# EAGLE design vacuum_sensor (EAGLE 6.5.0)
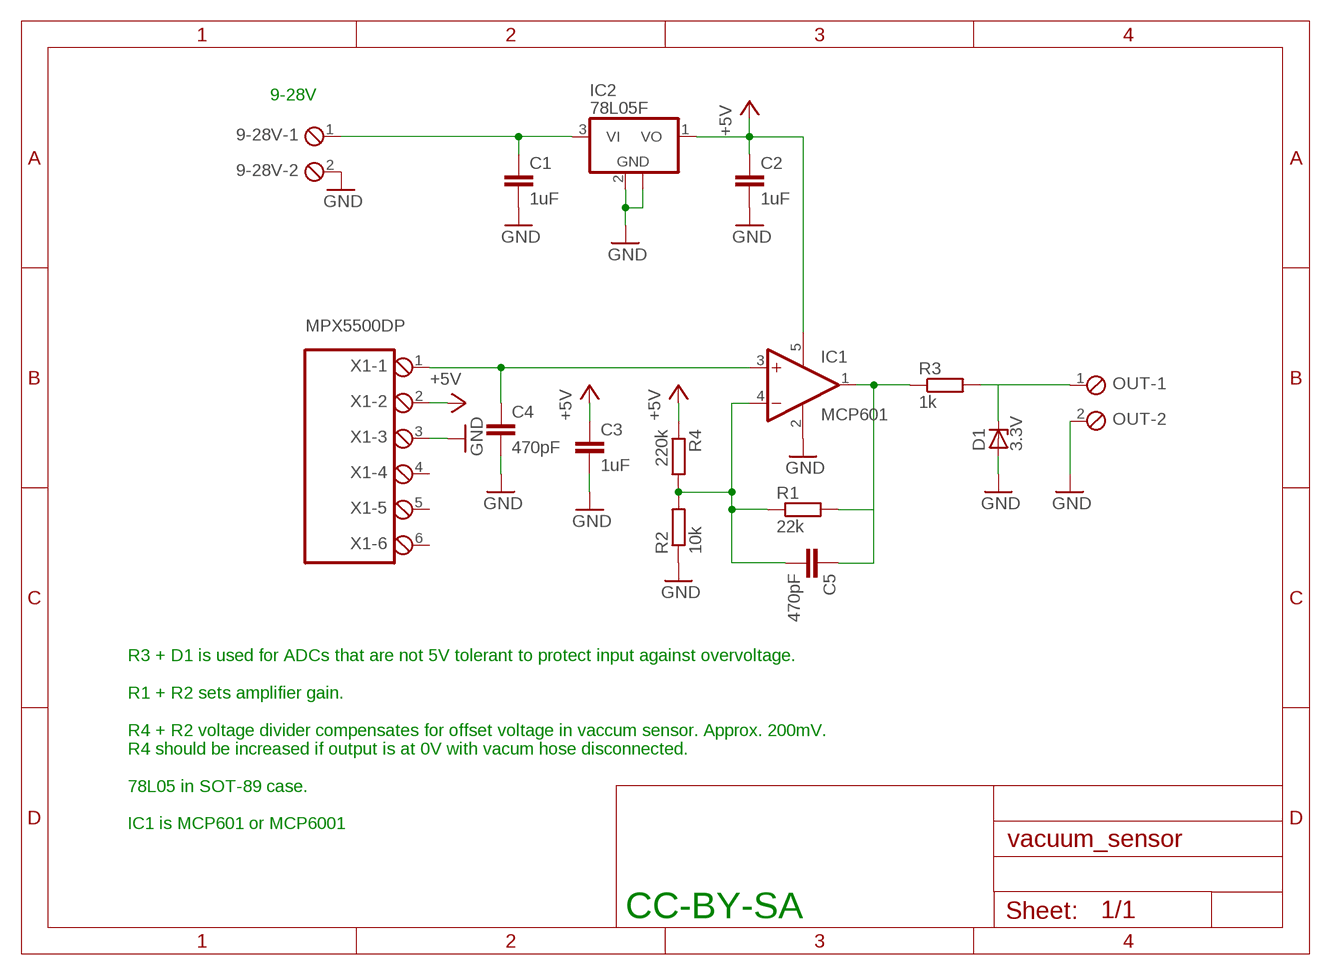
[diagram p0: schematic, sheet 1]

## Parts
9-28V  MPT2  [2POL254]
C1  1uF  C-EUC0805  [C0805]
C2  1uF  C-EUC0805  [C0805]
C3  1uF  C-EUC0805  [C0805]
C4  470pF  C-EUC0805  [C0805]
C5  470pF  C-EUC0805  [C0805]
D1  3.3V  ZENER-DIODESOT23  [SOT23]
IC1  MCP601  MCP601OT  [SOT23-5]
IC2  78L05F  [SOT89]
OUT  MPT2  [2POL254]
R1  22k  R-EU_R0805  [R0805]
R2  10k  R-EU_R0805  [R0805]
R3  1k  R-EU_R0805  [R0805]
R4  220k  R-EU_R0805  [R0805]
X1  MPT6  [6POL254]

## Nets
+5V: C2.1 C3.1 IC1.5(V+) IC2.1(VO) R4.1 X1.2
GND: 9-28V.2 C1.2 C2.2 C3.2 C4.2 D1.1(A) IC1.2(V-) IC2.2(GND) IC2.2@1(GND) OUT.2 R2.1 X1.3
N$1: C5.2 IC1.4(-IN) R1.1 R2.2 R4.2
N$2: 9-28V.1 C1.1 IC2.3(VI)
N$3: C5.1 IC1.1(OUT) R1.2 R3.1
N$4: C4.1 IC1.3(+IN) X1.1
N$5: D1.3(C) OUT.1 R3.2
Unconnected: X1.4 X1.5 X1.6

## Notes on the sheet
- 9-28V
- MPX5500DP
- R3 + D1 is used for ADCs that are not 5V tolerant to protect input against overvoltage. 
  
  R1 + R2 sets amplifier gain.
  
  R4 + R2 voltage divider compensates for offset voltage in vaccum sensor. Approx. 200mV.   
  R4 should be increased if output is at 0V with vacum hose disconnected. 
  
  78L05 in SOT-89 case.
  
  IC1 is MCP601 or MCP6001
- CC-BY-SA

## Library data of the parts
9-28V OUT = con-phoenix-254:MPT2: PHOENIX CONNECTOR; OC_FARNELL: unknown; OC_NEWARK: unknown
C1-C5 = rcl:C-EU: CAPACITOR, European symbol
D1 = diode:ZENER-DIODE: Z-Diode
IC1 = linear:MCP601: Single Op Amp 2.7V to 6.0V Single Supply CMOS Source: http://ww1.microchip.com/downloads/en/DeviceDoc/21314g.pdf
IC2 = linear:78L*: POSITOIV-VOLTAGE REGULATORS Output up to 100 mA Source: http://focus.ti.com/lit/ds/symlink/ua78l05.pdf
R1-R4 = rcl:R-EU_: RESISTOR, European symbol
X1 = con-phoenix-254:MPT6: PHOENIX CONNECTOR; OC_FARNELL: unknown; OC_NEWARK: unknown

## Board
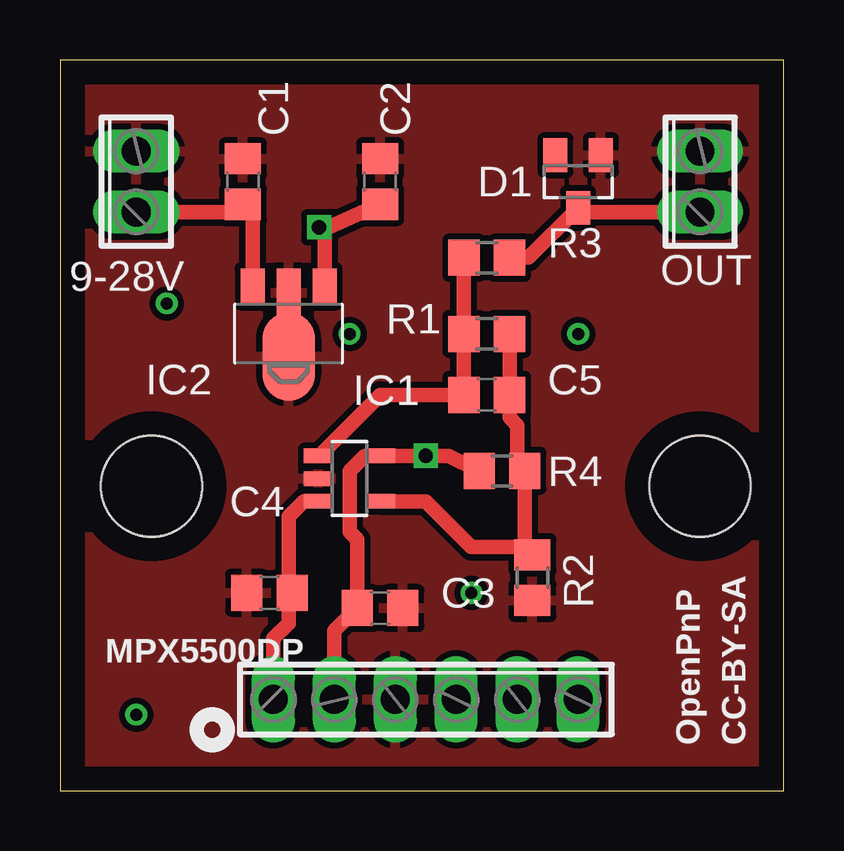
[diagram p1: board, top side]
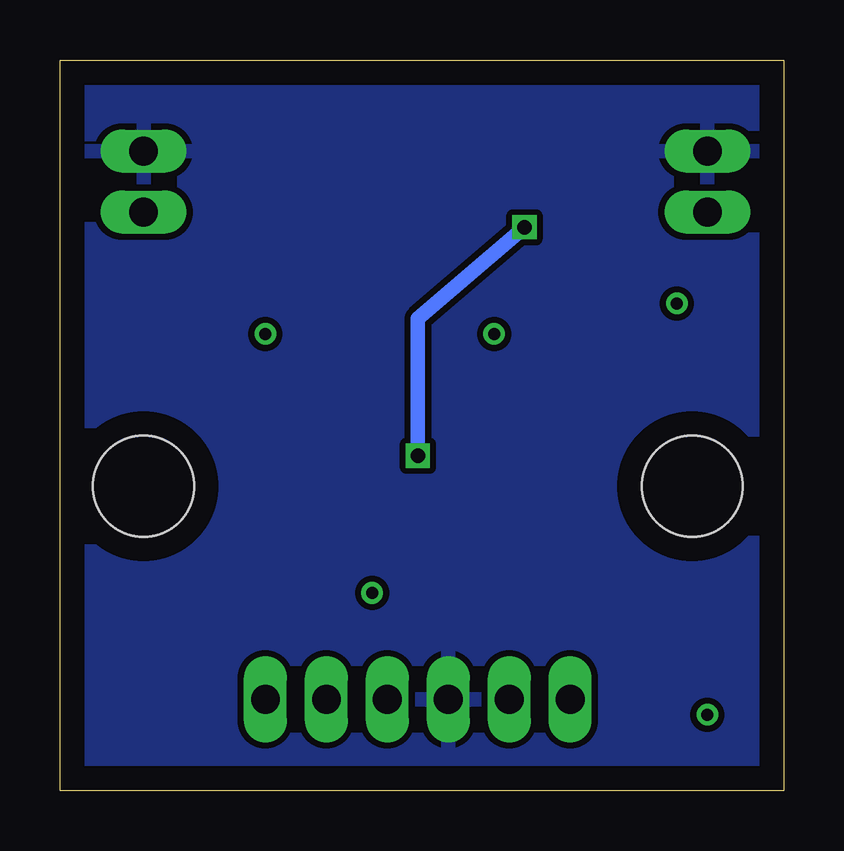
[diagram p2: board, bottom side, seen from below]

Size 30.15 x 30.47 mm. Coordinates in mm from the lower left corner, seen from the top.
Outline: 0,0 30.15,0 30.15,30.47 0,30.47 0,0
Copper layers (1*16): Top 0.035mm / dielectric 1.5mm / Bottom 0.035mm
Design rules "default *": minimum track width 10mil, minimum drill 24mil, track to track 10mil, track to pad 10mil, pad to pad 10mil, via to via 10mil, smd to smd 8mil, copper to edge 40mil, drill to drill 8mil, minimum pad ring 10mil, minimum via ring 8mil, stop-mask expansion 4mil, vias tented up to drill 0mil, thermal gap 10mil
Holes 4.2 mm at 3.81,12.7 26.67,12.7

### Footprints (pad centres in the part's own frame; a part is rotated, then mirrored left to right if it is on the bottom)
2POL254 = drill 1.2 long: 1 -1.27,0; 2 1.27,0
C0805 = smd 1.3 x 1.5: 1 -0.95,0; 2 0.95,0
SOT23 = smd 1 x 1.4: 1 -0.95,-1.1; 2 0.95,-1.1; 3 0,1.1
SOT23-5 = smd 0.6 x 1.2: 1 -0.95,-1.306; 2 0,-1.306; 3 0.95,-1.306; 4 0.95,1.306; 5 -0.95,1.306
SOT89 = smd 1 x 1.5: 1 -1.499,-1.981; 3 1.499,-1.981 | smd 1 x 2: 2 0,-1.727 | smd 2.2 x 3.7: 2@1 0,0.94
R0805 = smd 1.3 x 1.5: 1 -0.95,0; 2 0.95,0
6POL254 = drill 1.2 pad 1.778 long: 1 -6.35,0; 2 -3.81,0; 3 -1.27,0; 4 1.27,0; 5 3.81,0; 6 6.35,0

### Placement (x,y rotation side)
9-28V  3.18,25.4 90 top
C1  7.62,25.4 90 top
C2  13.33,25.4 90 top
C3  13.33,7.62 0 top
C4  8.73,8.26 180 top
C5  17.78,16.51 0 top
D1  21.59,25.4 180 top
IC1  12.06,13.02 270 top
IC2  9.53,19.05 180 top
OUT  26.67,25.4 90 top
R1  17.78,19.05 180 top
R2  19.69,8.89 90 top
R3  17.78,22.23 0 top
R4  18.41,13.34 0 top
X1  15.24,3.81 0 top

### Tracks (layer width: path | path; a pad name or v marks a point on that pad's centre or on a via)
+5V  (via drill 0.6)
  Top 0.61: X1.2 11.43,6.67 C3.1 12.38,10.47 12.06,10.79 12.06,13.34 12.7,13.97 IC1.5 v15.24,13.97 16.2,13.97 R4.1 | C2.1 11.02,23.41 IC2.1 11.02,23.09 v10.79,23.5
  Bottom 0.61: v10.79,23.5 15.24,19.68 v15.24,13.97
GND
  pour Top: -0.32,31.11 30.64,31.11 30.64,-0.32 -0.32,-0.32
  pour Bottom: -0.63,31.11 31.12,31.11 31.12,-0.64 -0.63,-0.64
N$1
  Top 0.61: IC1.4 15.24,12.07 17.15,10.16 19.37,10.16 | 19.37,10.16 R2.2 | 19.37,10.16 R4.2 19.05,13.65 19.05,15.24 18.73,15.56 C5.2 R1.1
N$2
  Top 0.61: IC2.3 8.03,24.04 C1.1 7.3,24.13 9-28V.1
N$3
  Top 0.61: R3.1 R1.2 C5.1 13.33,16.51 10.79,13.97 IC1.1
N$4
  Top 0.61: IC1.3 10.16,12.07 9.53,11.43 9.53,8.41 C4.1 9.53,8.1 9.53,6.99 8.89,6.35 X1.1
N$5
  Top 0.61: R3.2 19.52,22.23 D1.3 21.76,24.13 OUT.1
N$6  (via drill 0.5)
  other vias: 3.18,3.17 12.06,19.05 21.59,19.05 17.15,8.26 4.45,20.32

### Text on the board
tPlace: MPX5500DP | OpenPnP | CC-BY-SA